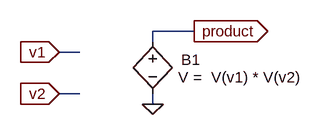
[diagram p0: schematic multiplier_module.asc]
multiplier_module.asc, the LTspice schematic file:
Version 4
SHEET 1 880 680
WIRE 240 160 176 160
WIRE 176 176 176 160
WIRE 64 192 32 192
WIRE 64 256 32 256
WIRE 176 272 176 256
FLAG 32 192 v1
IOPIN 32 192 In
FLAG 32 256 v2
IOPIN 32 256 In
FLAG 176 272 0
FLAG 240 160 product
IOPIN 240 160 Out
SYMBOL bv 176 160 R0
WINDOW 0 44 44 Left 0
WINDOW 3 39 71 Left 0
SYMATTR InstName B1
SYMATTR Value V =  V(v1) * V(v2)

The netlist it stands for:
* multiplier_module.asc
B1 product 0 V =  V(v1) * V(v2)
.backanno
.end